# EAGLE design fb_atmega_2te (EAGLE 6.4)
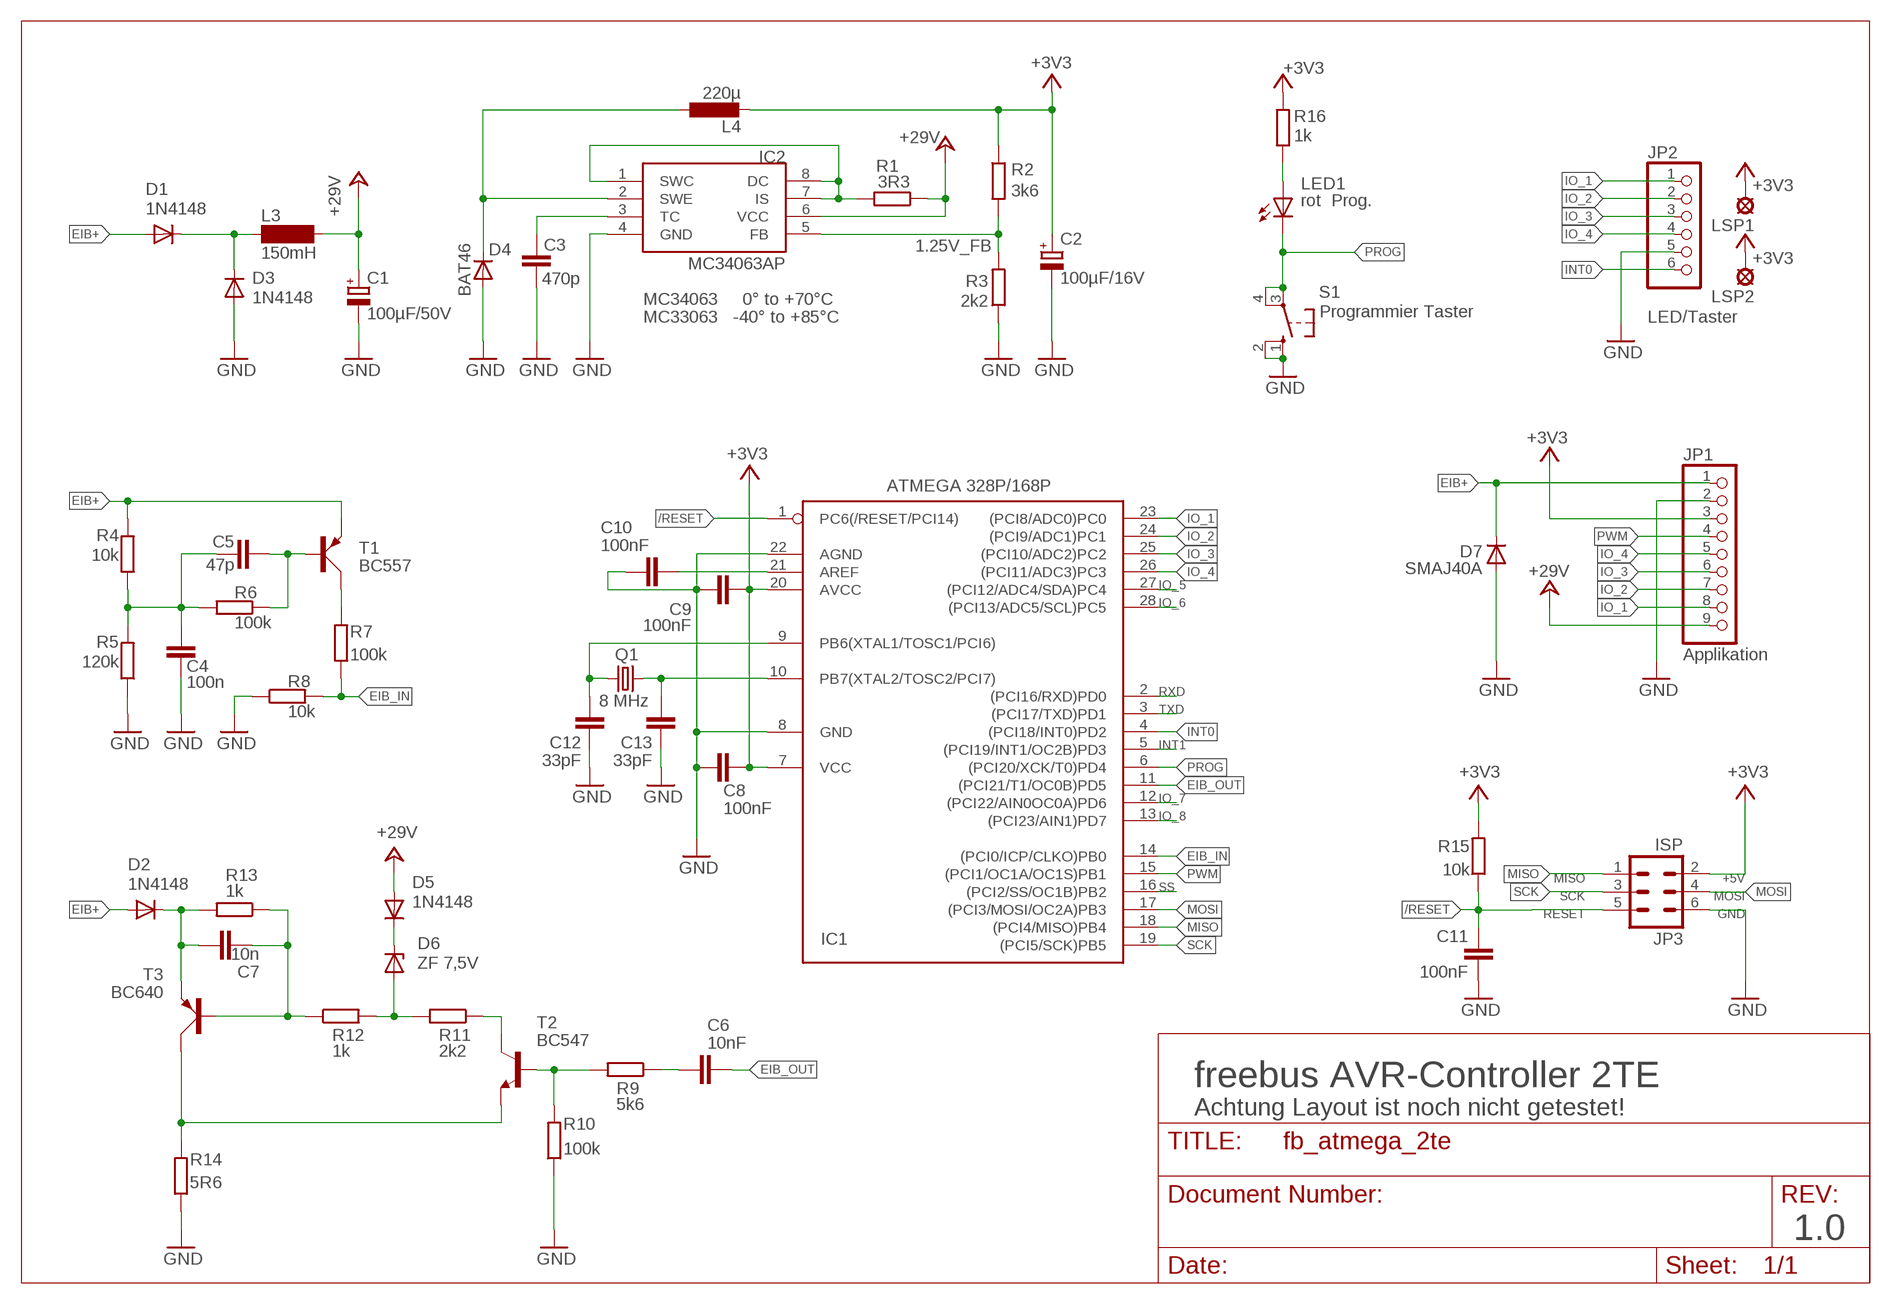
[diagram p0: schematic, sheet 1]

## Parts
C1  100µF/50V  CPOL-EUE3.5-8  [E3,5-8]
C2  100µF/16V  CPOL-EUE2-5  [E2-5]
C3  470p  C-EU025-024X044  [C025-024X044]
C4  100n  C-EU025-024X044  [C025-024X044]
C5  47p  C-EU025-024X044  [C025-024X044]
C6  10nF  C-EU025-024X044  [C025-024X044]
C7  10n  C-EU025-024X044  [C025-024X044]
C8  100nF  C-EUC0805  [C0805]
C9  100nF  C-EUC0805  [C0805]
C10  100nF  C-EUC0805  [C0805]
C11  100nF  C-EU025-024X044  [C025-024X044]
C12  33pF  C-EU025-024X044  [C025-024X044]
C13  33pF  C-EU025-024X044  [C025-024X044]
D1  1N4148  [D-2.5]
D2  1N4148  [D-2.5]
D3  1N4148  [D-2.5]
D4  BAT46  1N4148  [D-2.5]
D5  1N4148  [D-2.5]
D6  ZF 7,5V  ZENER-DIODEZD-2.5  [ZDIO-2.5]
D7  SMAJ40A  D-SMB  [SMB]
IC1  ATMEGA 328P/168P  ATMEGA168-20P  [DIL28-3]
IC2  MC34063AP  [DIL08]
JP1  Applikation  PINHD-1X9  [1X09]
JP2  LED/Taster  PINHD-1X6  [1X06]
JP3  ISP  ISP_6POLPINHD2X3  [2X03]
L3  150mH  BS11  [BS11]
L4  220µ  L-EU0207/2V  [0207/2V]
LED1  rot Prog.  LED3MM  [LED3MM]
LSP1  LSP10  [LSP10]
LSP2  LSP10  [LSP10]
Q1  8 MHz  CRYSTALHC49U-V  [HC49U-V]
R1  3R3  R-EU_0207/2V  [0207/2V]
R2  3k6  R-EU_0207/2V  [0207/2V]
R3  2k2  R-EU_0207/2V  [0207/2V]
R4  10k  R-EU_0207/2V  [0207/2V]
R5  120k  R-EU_0207/2V  [0207/2V]
R6  100k  R-EU_0207/2V  [0207/2V]
R7  100k  R-EU_0207/2V  [0207/2V]
R8  10k  R-EU_0207/2V  [0207/2V]
R9  5k6  R-EU_0207/2V  [0207/2V]
R10  100k  R-EU_0207/2V  [0207/2V]
R11  2k2  R-EU_0207/2V  [0207/2V]
R12  1k  R-EU_0207/2V  [0207/2V]
R13  1k  R-EU_0207/2V  [0207/2V]
R14  5R6  R-EU_0207/2V  [0207/2V]
R15  10k  R-EU_0207/2V  [0207/2V]
R16  1k  R-EU_0207/2V  [0207/2V]
S1  Programmier Taster  10-XX  [B3F-10XX]
T1  BC557  [SOT54A]
T2  BC547  [TO92]
T3  BC640  [SOT54D]

## Nets
1.25V_FB: IC2.5(FB) R2.2 R3.2
+3V3: C2.+ C8.1 C9.1 IC1.7(VCC) IC1.20(AVCC) JP1.3 JP3.2 L4.2 LSP1.MP LSP2.MP R2.1 R15.2 R16.1
+24V: C1.+ D5.A IC2.6(VCC) JP1.9 L3.2 R1.1 ; supply symbol labelled +29V
/RESET: C11.2 IC1.1(PC6(/RESET/PCI14)) JP3.5 R15.1
EIB+: D1.A D2.A D7.1(C) JP1.1 R4.2 T1.E
EIB_IN: IC1.14((PCI0/ICP/CLKO)PB0) R7.1 R8.2
EIB_OUT: C6.2 IC1.11((PCI21/T1/OC0B)PD5)
GND: C1.- C2.- C3.1 C4.1 C8.2 C9.2 C10.1 C11.1 C12.2 C13.2 D3.A D4.A D7.2(A) IC1.8(GND) IC1.22(AGND) IC2.4(GND) JP1.2 JP2.5 JP3.6 R3.1 R5.1 R8.1 R10.1 R14.1 S1.1(S) S1.2(S1)
INT0: IC1.4((PCI18/INT0)PD2) JP2.6
INT1: IC1.5((PCI19/INT1/OC2B)PD3)
IO_1: IC1.23((PCI8/ADC0)PC0) JP1.8 JP2.1
IO_2: IC1.24((PCI9/ADC1)PC1) JP1.7 JP2.2
IO_3: IC1.25((PCI10/ADC2)PC2) JP1.6 JP2.3
IO_4: IC1.26((PCI11/ADC3)PC3) JP1.5 JP2.4
IO_5: IC1.27((PCI12/ADC4/SDA)PC4)
IO_6: IC1.28((PCI13/ADC5/SCL)PC5)
IO_7: IC1.12((PCI22/AIN0OC0A)PD6)
IO_8: IC1.13((PCI23/AIN1)PD7)
MISO: IC1.18((PCI4/MISO)PB4) JP3.1
MOSI: IC1.17((PCI3/MOSI/OC2A)PB3) JP3.4
N$9: LED1.A R16.2
N$13: C4.2 C5.1 R4.1 R5.2 R6.2
N$14: R7.2 T1.C
N$16: C10.2 IC1.21(AREF)
N$17: IC2.1(SWC) IC2.7(IS) IC2.8(DC) R1.2
N$18: D1.C D3.C L3.1
N$19: C6.1 R9.1
N$20: R9.2 R10.2 T2.2(B)
N$21: C7.2 R12.1 R13.1 T3.B
N$23: D5.C D6.C
N$26: D4.C IC2.2(SWE) L4.1
N$27: C3.2 IC2.3(TC)
N$31: D6.A R11.2 R12.2
N$33: C5.2 R6.1 T1.B
N$34: R11.1 T2.3(C)
N$35: R14.2 T2.1(E) T3.C
N$36: C7.1 D2.C R13.2 T3.E
N$38: C13.1 IC1.10(PB7(XTAL2/TOSC2/PCI7)) Q1.2
N$39: C12.1 IC1.9(PB6(XTAL1/TOSC1/PCI6)) Q1.1
PROG: IC1.6((PCI20/XCK/T0)PD4) LED1.K(C) S1.3(P) S1.4(P1)
PWM: IC1.15((PCI1/OC1A/OC1S)PB1) JP1.4
RXD: IC1.2((PCI16/RXD)PD0)
SCK: IC1.19((PCI5/SCK)PB5) JP3.3
SS: IC1.16((PCI2/SS/OC1B)PB2)
TXD: IC1.3((PCI17/TXD)PD1)

## Notes on the sheet
- MC34063     0° to +70°C
- MC33063   -40° to +85°C
- freebus AVR-Controller 2TE
- Achtung Layout ist noch nicht getestet!
- 1.0

## Library data of the parts
C1 C2 = rcl:CPOL-EU: POLARIZED CAPACITOR, European symbol
C3-C13 = rcl:C-EU: CAPACITOR, European symbol
D1-D5 = diode:1N4148: DIODE high speed (Philips)
D6 = diode:ZENER-DIODE: Z-Diode
D7 = semicon-smd-ipc:D-: DIODE unfilled
IC1 = avr:ATMEGA168*P: MICROCONTROLLER 16 kBytes FLASH 1 kBytes SRAM 512 Bytes EEPROM USART 8-channel 10 bit ADC
IC2 = mc34063:MC34063
JP1 = pinhead:PINHD-1X9: PIN HEADER
JP2 = pinhead:PINHD-1X6: PIN HEADER
JP3 = avr:ISP_6POL
L3 = Uwe:BS: INDUCTOR nominal inductance, magnetically screened; OC_FARNELL: unknown; OC_NEWARK: unknown
L4 = rcl:L-EU: INDUCTOR, European symbol
LED1 = Uwe:LED: LED OSRAM: - CHIPLED LG R971, LG N971, LY N971, LG Q971, LY Q971, LO R971, LY R971 LH N974, LH R974 LS Q976, LO Q976, LY Q976 LO Q996 - Hyper CHIPLED LW Q18S LB Q993, LB Q99A, LB R99A - SideLED LS A670, LO A670, LY A670, LG A670, LP A670 LB A673, LV A673, LT A673, LW A673 LH A674 LY A675 LS A676, LA A676, LO A676, LY A676, LW A676 LS A679, LY A679, LG A679 - Hyper Micro SIDELED® LS Y876, LA Y876, LO Y876, LY Y876 LT Y87S - SmartLED LW L88C, LW L88S LB L89C, LB L89S, LG L890 LS L89K, LO L89K, LY L89K LS L896, LA L896, LO L896, LY L896 - TOPLED LS T670, LO T670, LY T670, LG T670, LP T670 LSG T670, LSP T670, LSY T670, LOP T670, LYG T670 LG T671, LOG T671, LSG T671 LB T673, LV T673, LT T673, LW T673 LH T674 LS T676, LA T676, LO T676, LY T676, LB T676, LH T676, LSB T676, LW T676 LB T67C, LV T67C, LT T67C, LS T67K, LO T67K, LY T67K, LW E67C LS E67B, LA E67B, LO E67B, LY E67B, LB E67C, LV E67C, LT E67C LW T67C LS T679, LY T679, LG T679 LS T770, LO T770, LY T770, LG T770, LP T770 LB T773, LV T773, LT T773, LW T773 LH T774 LS E675, LA E675, LY E675, LS T675 LS T776, LA T776, LO T776, LY T776, LB T776 LHGB T686 LT T68C, LB T68C - Hyper Mini TOPLED® LB M676 - Mini TOPLED Santana® LG M470 LS M47K, LO M47K, LY M47K Source: http://www.osram.convergy.de LUXEON: - LUMILED® LXK2-PW12-R00, LXK2-PW12-S00, LXK2-PW14-U00, LXK2-PW14-V00 LXK2-PM12-R00, LXK2-PM12-S00, LXK2-PM14-U00 LXK2-PE12-Q00, LXK2-PE12-R00, LXK2-PE12-S00, LXK2-PE14-T00, LXK2-PE14-U00 LXK2-PB12-K00, LXK2-PB12-L00, LXK2-PB12-M00, LXK2-PB14-N00, LXK2-PB14-P00, LXK2-PB14-Q00 LXK2-PR12-L00, LXK2-PR12-M00, LXK2-PR14-Q00, LXK2-PR14-R00 LXK2-PD12-Q00, LXK2-PD12-R00, LXK2-PD12-S00 LXK2-PH12-R00, LXK2-PH12-S00 LXK2-PL12-P00, LXK2-PL12-Q00, LXK2-PL12-R00 Source: www.luxeon.com KINGBRIGHT: KA-3528ASYC Source: www.kingbright.com
LSP1 LSP2 = solpad:LSP10: SOLDER PAD drill 1.0 mm, distributor Buerklin, 12H555
Q1 = crystal:CRYSTAL: CRYSTAL; OC_FARNELL: 1666969; OC_NEWARK: unknown
R1-R16 = rcl:R-EU_: RESISTOR, European symbol
S1 = switch-omron:10-XX: OMRON SWITCH; MPN: B3F-1000; OC_FARNELL: 176432; OC_NEWARK: 36M3542
T1 = transistor-small-signal:BC557: PNP TRANSISTOR
T2 = transistor:BC547: NPN TRANSISTOR
T3 = transistor-small-signal:BC640: PNP TRANSISTOR

## Board
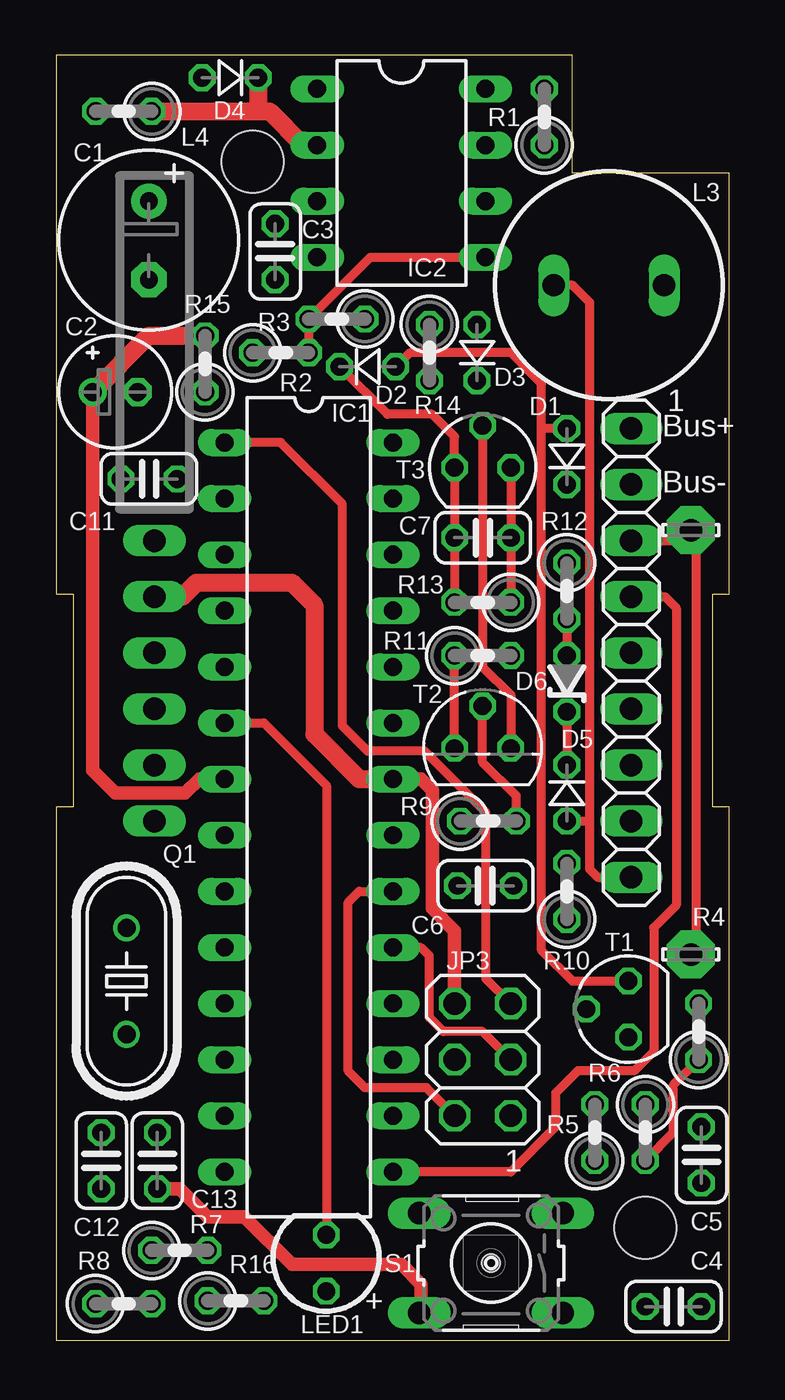
[diagram p1: board, top side]
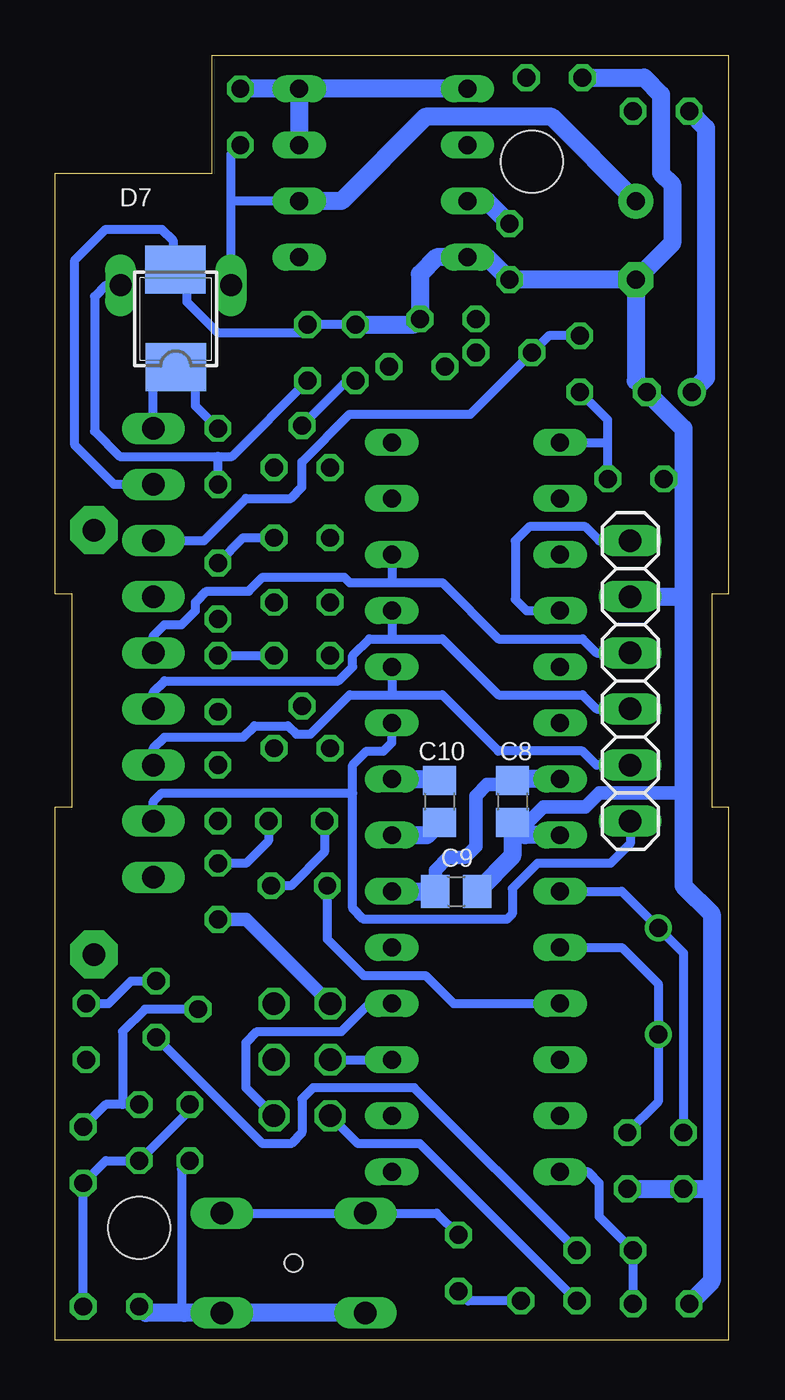
[diagram p2: board, bottom side, seen from below]

Size 30.48 x 58.17 mm. Coordinates in mm from the lower left corner, seen from the top.
Outline: 0,0 30.48,0 30.48,24.13 29.72,24.13 29.72,33.78 30.48,33.78 30.48,52.83 23.37,52.83 23.37,57.91 23.37,58.17 0,58.17 0,33.78 0.76,33.78 0.76,24.13 0,24.13 0,0
Copper layers (1*16): Top 0.035mm / dielectric 1.5mm / Bottom 0.035mm
Design rules "HAKA Zwillingsangebot": minimum track width 0.2mm, minimum drill 0.5mm, track to track 0.2mm, track to pad 0.2mm, pad to pad 0.15mm, via to via 0.2mm, smd to smd 0mil, copper to edge 0.2mm, drill to drill 0.2mm, minimum pad ring 0.2mm, minimum via ring 0.2mm, stop-mask expansion 0.1mm, vias tented up to drill 0mil, thermal gap 10mil
Holes 2.8 mm at 26.67,5.08 8.89,53.34
Holes 0.8 mm at 19.68,3.49

### Footprints (pad centres in the part's own frame; a part is rotated, then mirrored left to right if it is on the bottom)
E3,5-8 = drill 0.813 pad 1.6: + -1.778,0 | drill 0.813 pad 1.6 octagon: - 1.778,0
E2-5 = drill 0.813 pad 1.27: + -1.016,0 | drill 0.813 pad 1.27 octagon: - 1.016,0
C025-024X044 = drill 0.813 octagon: 1 -1.27,0; 2 1.27,0
C0805 = smd 1.3 x 1.5: 1 -0.95,0; 2 0.95,0
D-2.5 = drill 0.813 octagon: A 1.27,0; C -1.27,0
ZDIO-2.5 = drill 0.813 octagon: A 1.27,0; C -1.27,0
SMB = smd 2.159 x 2.743: 1 -2.311,-0.127; 2 2.108,-0.102
DIL28-3 = drill 0.813 long: 1 -16.51,-3.81; 2 -13.97,-3.81; 3 -11.43,-3.81; 4 -8.89,-3.81; 5 -6.35,-3.81; 6 -3.81,-3.81; 7 -1.27,-3.81; 8 1.27,-3.81; 9 3.81,-3.81; 10 6.35,-3.81; 11 8.89,-3.81; 12 11.43,-3.81; 13 13.97,-3.81; 14 16.51,-3.81; 15 16.51,3.81; 16 13.97,3.81; 17 11.43,3.81; 18 8.89,3.81; 19 6.35,3.81; 20 3.81,3.81; 21 1.27,3.81; 22 -1.27,3.81; 23 -3.81,3.81; 24 -6.35,3.81; 25 -8.89,3.81; 26 -11.43,3.81; 27 -13.97,3.81; 28 -16.51,3.81
DIL08 = drill 0.813 long: 1 -3.81,-3.81; 2 -1.27,-3.81; 3 1.27,-3.81; 4 3.81,-3.81; 5 3.81,3.81; 6 1.27,3.81; 7 -1.27,3.81; 8 -3.81,3.81
1X09 = drill 1.016 long: 1 -10.16,0; 2 -7.62,0; 3 -5.08,0; 4 -2.54,0; 5 0,0; 6 2.54,0; 7 5.08,0; 8 7.62,0; 9 10.16,0
1X06 = drill 1.016 long: 1 -6.35,0; 2 -3.81,0; 3 -1.27,0; 4 1.27,0; 5 3.81,0; 6 6.35,0
2X03 = drill 1.016 octagon: 1 -2.54,-1.27; 2 -2.54,1.27; 3 0,-1.27; 4 0,1.27; 5 2.54,-1.27; 6 2.54,1.27
BS11 = drill 1 long: 1 -2.5,0; 2 2.5,0
0207/2V = drill 0.813 octagon: 1 -1.27,0; 2 1.27,0
LED3MM = drill 0.813 octagon: A -1.27,0; K 1.27,0
LSP10 = drill 1.016 pad 2.159 octagon: MP 0,0
HC49U-V = drill 0.813: 1 -2.413,0; 2 2.413,0
B3F-10XX = drill 1.016 long: 1 -3.251,2.261; 2 3.251,2.261; 3 -3.251,-2.261; 4 3.251,-2.261
SOT54A = drill 0.813 octagon: B 0,1.905; C -1.27,0; E 1.27,0
TO92 = drill 0.813 octagon: 1 1.27,0; 2 0,1.905; 3 -1.27,0
SOT54D = drill 0.813 octagon: B 1.27,0; C 0,1.905; E -1.27,0

### Placement (x,y rotation side)
C1  4.19,49.78 270 top
C2  2.67,42.93 0 top
C3  9.91,49.28 90 top
C4  27.94,1.52 0 top
C5  29.21,8.38 90 top
C6  19.43,20.57 180 top
C7  19.3,36.32 0 top
C8  9.78,24.38 270 bottom
C9  12.32,20.32 0 bottom
C10  13.08,24.38 270 bottom
C11  4.19,38.99 0 top
C12  2.03,8.13 270 top
C13  4.57,8.13 270 top
D1  23.11,40.01 90 top
D2  14.1,44.07 0 top
D3  19.05,44.7 90 top
D4  7.87,57.15 180 top
D5  23.11,24.77 270 top
D6  23.11,29.72 90 top
D7  25.15,46.35 90 bottom
IC1  11.43,24.13 270 top
IC2  15.62,52.83 270 top
JP1  26.03,31.12 270 top
JP2  4.44,29.85 90 bottom
JP3  19.3,12.7 90 top
L3  25.02,47.75 180 top
L4  3.05,55.63 180 top
LED1  12.22,3.49 90 top
LSP1  28.73,36.67 0 top
LSP2  28.73,17.46 0 top
Q1  3.17,16.26 270 top
R1  22.1,55.37 90 top
R2  10.16,44.7 0 top
R3  12.7,46.23 180 top
R4  29.08,13.97 90 top
R5  24.38,9.4 90 top
R6  26.67,9.4 270 top
R7  5.59,4.06 0 top
R8  3.05,1.65 0 top
R9  19.56,23.5 0 top
R10  23.11,20.32 90 top
R11  19.3,30.99 0 top
R12  23.11,33.91 270 top
R13  19.3,33.4 180 top
R14  16.89,44.7 270 top
R15  6.73,44.2 90 top
R16  8.13,1.78 0 top
S1  19.68,3.49 180 top
T1  25.91,14.99 90 top
T2  19.3,26.8 0 top
T3  19.3,39.5 0 top

### Tracks (layer width: path | path; a pad name or v marks a point on that pad's centre or on a via)
1.25V_FB
  Top 0.406: IC2.5 14.22,49.02 R3.2 R2.2
+3V3
  Top 0.406: JP3.2 16.76,11.43 13.97,11.43 13.21,12.19 13.21,19.81 13.72,20.32 IC1.20 | LSP2.MP 28.96,17.69 28.96,36.44 LSP1.MP 28.25,36.2 JP1.3
  Top 0.61: C2.+ 1.65,25.78 2.67,24.77 5.84,24.77 6.48,25.4 IC1.7
  Top 0.813: C2.+ 4.19,45.47 R15.2
  Bottom 0.406: R15.2 8.13,45.47 R2.1 11.68,41.91 17.14,41.91 19.3,39.75 19.3,38.61 19.81,38.1 21.84,38.1 23.75,36.2 JP1.3 | R16.1 13.97,8.89 16.76,8.89 JP3.2
  Bottom 0.61: C9.1 13.27,21.27 12.7,21.84 11.94,21.84 11.43,22.35 11.43,24.64 10.92,25.15 9.97,25.15 C8.1
  Bottom 0.813: L4.2 1.02,54.86 1.02,43.56 C2.+ | IC1.7 9.71,25.4 C8.1 | IC1.20 C9.1
+24V
  Top 0.406: 24.15,23.5 24.15,21.32 24.51,20.95 JP1.9 | 24.15,23.5 24.15,46.97 23.37,47.75 L3.2 | JP1.9 | D5.A 24.15,23.5
  Bottom 0.406: L3.2 22.52,51.56 | 22.52,51.56 22.52,53.68 R1.1 | IC2.6 22.52,51.56
  Bottom 0.813: C1.+ 8,55.37 13.72,55.37 17.53,51.56 IC2.6
/RESET
  Top 0.406: JP3.5 19.43,16.38 19.43,23.91 16.67,26.67 14.1,26.67 12.95,27.81 12.95,37.85 10.16,40.64 IC1.1
  Bottom 0.406: C11.2 5.46,40.64 | 5.46,40.64 5.46,41.66 R15.1 | IC1.1 5.46,40.64
EIB+
  Top 0.406: 21.97,41.27 21.97,17.65 23.37,16.26 T1.E | 21.97,41.27 21.97,43.31 20.57,44.7 16,44.7 D2.A | D1.A 21.97,41.27
  Bottom 0.406: JP1.1 26.04,44.04 D7.1 24.23,44.04 24.13,43.94 24.13,42.29 D1.A | R4.2 28.07,15.24 27.05,16.26 T1.E
EIB_IN
  Bottom 0.406: R8.2 R7.1 5.84,5.59 5.84,7.11 6.35,7.62 IC1.14
EIB_OUT
  Bottom 0.406: C6.2 18.16,18.16 16.51,16.51 13.72,16.51 12.45,15.24 IC1.11
GND
  Top 0.61: JP3.6 18.03,18.52 17.02,19.54 17.02,24.89 16.51,25.4 IC1.22 | C13.2 5.59,6.86 6.86,5.59 8.51,5.59 10.67,3.43 15.62,3.43 16.51,2.54 16.51,1.31 S1.2
  Top 0.813: JP2.5 5.71,33.66 6.35,34.29 10.67,34.29 11.68,33.27 11.68,27.43 13.72,25.4 IC1.22
  Bottom 0.406: R14.1 D3.A 19.43,45.59 22.86,45.59 23.11,45.59 24.51,46.99 24.51,47.88 25.04,48.41 D7.2 25.15,48.56 25.15,49.78 25.65,50.29 28.19,50.29 29.59,48.9 29.59,40.51 27.81,38.73 JP1.2 | R5.1 24.77,7.75 24.77,1.36 24.64,1.23
  Bottom 0.61: JP3.6 21.84,19.05 R10.1 | IC1.8 7.62,22.99 | 2.03,24.77 5.84,24.77 6.48,24.13 8.38,24.13 9.43,23.08
  Bottom 0.813: S1.2 S1.1 24.64,1.23 26.38,1.23 C4.1 | C1.- 4.19,43.43 C2.- 2.03,41.27 2.03,38.86 | C1.- C3.1 10.92,49.02 IC2.4 13.21,49.02 13.97,48.26 R3.1 14.22,45.97 R14.1 | D4.A 3.81,57.15 3.05,56.39 3.05,52.83 2.54,52.32 2.54,49.66 C1.- | 2.03,38.86 2.03,33.53 | 2.03,33.53 2.03,24.77 2.03,20.57 0.76,19.3 0.76,6.86 | C11.1 2.16,38.99 2.03,38.86 | IC1.22 13.15,25.4 C10.1 | IC1.8 9.21,22.86 9.43,23.08 C8.2 9.78,21.91 C9.2 | IC1.8 | 0.76,6.86 0.76,2.67 R8.1 | 0.76,6.86 C12.2 C13.2 | JP2.5 2.16,33.66 2.03,33.53
INT0
  Bottom 0.406: JP2.6 5.84,36.2 6.48,36.83 9.02,36.83 9.65,36.2 9.65,33.53 9.14,33.02 IC1.4
IO_1
  Bottom 0.406: JP2.1 4.45,22.48 5.33,21.59 8.64,21.59 9.78,20.45 9.78,19.3 10.03,19.05 16.51,19.05 17.02,19.56 17.02,24.77 | 17.02,24.77 17.02,26.04 16.38,26.67 15.62,26.67 15.24,27.05 IC1.23 | JP1.8 26.04,24.38 25.65,24.77 17.02,24.77
IO_2
  Bottom 0.406: JP1.7 26.04,26.8 25.53,27.3 21.97,27.3 21.46,27.81 19.94,27.81 19.56,27.43 18.92,27.43 17.14,29.21 15.24,29.21 | 15.24,29.21 12.95,29.21 10.41,26.67 6.6,26.67 5.97,26.04 JP2.2 | IC1.24 15.24,29.21
IO_3
  Bottom 0.406: JP1.6 26.04,29.34 25.53,29.84 17.65,29.84 17.02,30.48 17.02,30.99 16.26,31.75 15.24,31.75 | 15.24,31.75 12.95,31.75 10.41,29.21 6.6,29.21 5.97,28.57 JP2.3 | JP2.3 | IC1.25 15.24,31.75
IO_4
  Bottom 0.406: JP1.5 26.04,31.88 25.53,32.38 24.77,32.38 24.13,33.02 24.13,33.4 23.62,33.91 21.72,33.91 21.08,34.54 17.4,34.54 17.14,34.29 15.24,34.29 | 15.24,34.29 12.95,34.29 10.41,31.75 6.6,31.75 5.97,31.11 JP2.4 | IC1.26 15.24,34.29
MISO
  Bottom 0.406: JP3.1 21.84,11.43 21.84,13.46 21.34,13.97 17.53,13.97 16.26,15.24 IC1.18
MOSI
  Bottom 0.406: JP3.4 IC1.17
N$9
  Bottom 0.406: R16.2 11.78,1.78 LED1.A
N$13
  Top 0.406: R6.2 27.94,9.4 27.94,11.56 R4.1
  Bottom 0.406: C4.2 C5.1 28.19,8.13 R6.2 24.38,10.41 R5.2
N$14
  Bottom 0.406: R7.2 14.22,11.43 18.8,11.43 19.3,10.92 19.3,9.4 19.81,8.89 21.08,8.89 T1.C
N$16
  Bottom 0.813: IC1.21 13.65,22.86 C10.2
N$17
  Bottom 0.813: IC2.1 IC2.8 | IC2.8 R1.2 | IC2.8 IC2.7
N$18
  Bottom 0.406: L3.1 28.19,47.75 28.7,47.24 28.7,41.15 27.56,40.01 23.11,40.01 | 23.11,40.01 22.48,40.01 D3.C | D1.C 23.11,40.01
N$19
  Bottom 0.406: R9.1 18.29,22.1 19.81,20.57 C6.1
N$20
  Top 0.406: R9.2 20.83,24.64 19.3,26.16 T2.2
  Bottom 0.406: R9.2 20.83,22.61 21.84,21.59 R10.2
N$21
  Top 0.406: T3.B C7.2 R13.1
  Bottom 0.406: R12.1 21.97,36.32 C7.2
N$23
  Top 0.406: D6.C D5.C
N$26
  Top 0.813: L4.1 9.14,55.63 | 9.14,55.63 9.65,55.63 11.18,54.1 IC2.2 | D4.C 9.14,55.63
N$27
  Bottom 0.813: C3.2 10.92,51.56 IC2.3
N$31
  Top 0.406: R12.2 D6.A
  Bottom 0.406: D6.A R11.2
N$33
  Bottom 0.406: R6.1 27.43,10.67 | 27.43,10.67 28.19,10.67 C5.2 | T1.B 26.42,14.99 27.43,13.97 27.43,10.67
N$34
  Top 0.406: T2.3 R11.1
N$35
  Top 0.406: T3.C 19.3,30.48 20.57,29.21 T2.1
  Bottom 0.406: R14.2 17.27,43.43 T3.C
N$36
  Top 0.406: R13.2 C7.1 T3.E 18.03,40.89 17.02,41.91 14.99,41.91 D2.C
N$38
  Bottom 0.406: IC1.10 4.83,17.78 3.17,16.13 Q1.2 3.17,10.79 C13.1
N$39
  Bottom 0.406: IC1.9 4.83,20.32 Q1.1 2.03,17.53 C12.1
PROG
  Top 0.406: IC1.6 9.4,27.94 12.22,25.11 LED1.K
  Bottom 0.406: LED1.K 13.21,5.75 S1.4 S1.3
PWM
  Top 0.406: JP1.4 27.56,33.66 28.07,33.15 28.07,19.68 27.05,18.67 27.05,13.08 26.16,12.19 23.62,12.19 22.61,11.18 22.61,9.65 20.57,7.62 IC1.15
SCK
  Top 0.406: JP3.3 19.3,13.97 17.53,13.97 16.89,14.61 16.89,17.4 16.51,17.78 IC1.19

### Text on the board
tPlace: 1 | Bus+ | Bus- | 1 | +